# Altium schematic sheet ee453_pcb_N-B-S.SchDoc: EE 453 Capstone
size C; ApprovedBy: Your Name; CheckedBy: Your Name; Author: Your Name; CompanyName: Dept. of Elec. and Comp. Engg.; DrawnBy: Your Name; Engineer: Your Nmae; Organization: UW-Seattle; Address1: 185 Stevens Way; Address2: Paul Allen Center; Address3: Seattle, WA; Address4: US-98195; DocumentNumber: 1; Revision: 1.0; SheetNumber: 1; SheetTotal: 1
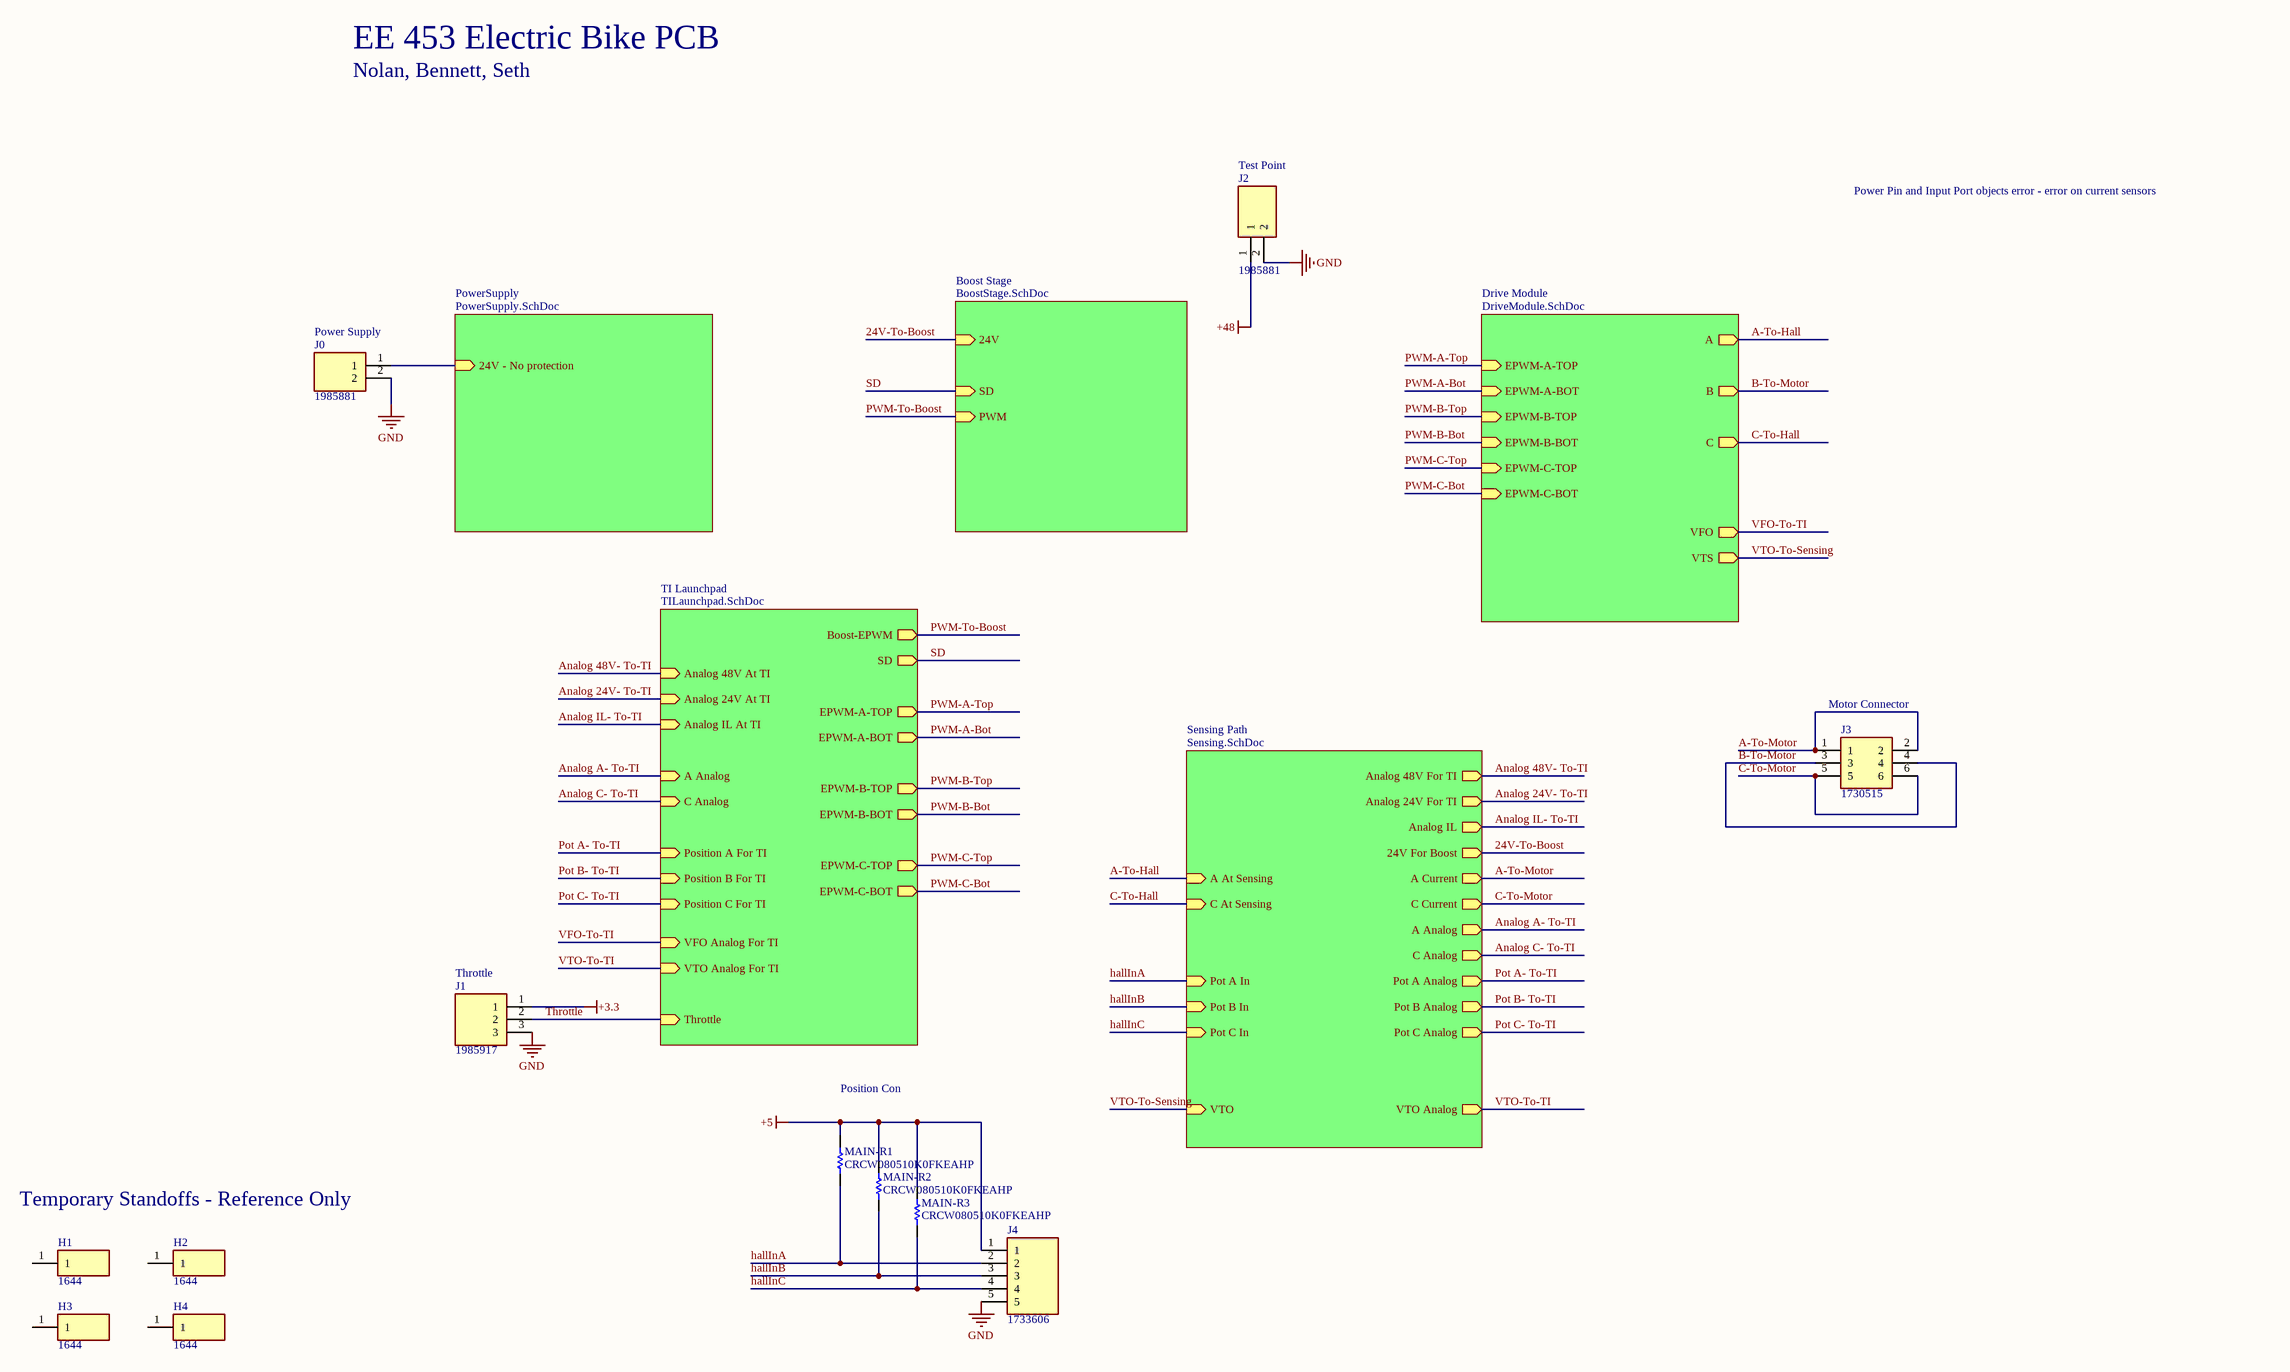
[diagram p0: ee453_pcb_N-B-S.SchDoc]

## Parts
H1  1644  [1644]
H2  1644  [1644]
H3  1644  [1644]
H4  1644  [1644]
J0  1985881  [1985881]
J1  1985917  [1985917]
J2  1985881  [1985881]
J3  1730515  [1730515]
J4  1733606  [1733606]
MAIN-R1  CRCW080510K0FKEAHP  [RESC2013X60X40NL15T20]
MAIN-R2  CRCW080510K0FKEAHP  [RESC2013X60X40NL15T20]
MAIN-R3  CRCW080510K0FKEAHP  [RESC2013X60X40NL15T20]

## Sub-sheets
Boost Stage = BoostStage.SchDoc: 24V (in), SD (in), PWM (in)
Drive Module = DriveModule.SchDoc: EPWM-A-TOP (in), EPWM-A-BOT (in), EPWM-B-TOP (in), EPWM-B-BOT (in), EPWM-C-TOP (in), EPWM-C-BOT (in), A (out), B (out), C (out), VFO (out), VTS (out)
PowerSupply = PowerSupply.SchDoc: 24V - No protection (in)
Sensing Path = Sensing.SchDoc: A At Sensing (in), C At Sensing (in), Analog 24V For TI (out), Analog IL (out), A Current (out), C Current (out), Analog 48V For TI (out), Pot A Analog (out), Pot B Analog (out), Pot C Analog (out), Pot A In (in), Pot B In (in), Pot C In (in), A Analog (out), C Analog (out), 24V For Boost (out), VTO Analog (out), VTO (in)
TI Launchpad = TILaunchpad.SchDoc: Analog 24V At TI (in), Analog IL At TI (in), A Analog (in), C Analog (in), Boost-EPWM (out), EPWM-A-TOP (out), EPWM-A-BOT (out), EPWM-B-TOP (out), EPWM-B-BOT (out), EPWM-C-TOP (out), EPWM-C-BOT (out), Position A For TI (in), Position B For TI (in), Position C For TI (in), SD (out), Analog 48V At TI (in), VFO Analog For TI (in), VTO Analog For TI (in), Throttle (in)

## Nets
+3.3: J1.1
+5: J4.1 MAIN-R1.2 MAIN-R2.2 MAIN-R3.2
+48: J2.1
GND: J0.2 J1.3 J2.2 J4.5
24V-To-Boost: sheet Boost Stage/24V, sheet Sensing Path/24V For Boost
A-To-Hall: sheet Drive Module/A, sheet Sensing Path/A At Sensing
A-To-Motor: J3.1 J3.2 ; sheet Sensing Path/A Current
Analog 24V- To-TI: sheet TI Launchpad/Analog 24V At TI, sheet Sensing Path/Analog 24V For TI
Analog 48V- To-TI: sheet TI Launchpad/Analog 48V At TI, sheet Sensing Path/Analog 48V For TI
Analog A- To-TI: sheet TI Launchpad/A Analog, sheet Sensing Path/A Analog
Analog C- To-TI: sheet TI Launchpad/C Analog, sheet Sensing Path/C Analog
Analog IL- To-TI: sheet TI Launchpad/Analog IL At TI, sheet Sensing Path/Analog IL
B-To-Motor: J3.3 J3.4 ; sheet Drive Module/B
C-To-Hall: sheet Drive Module/C, sheet Sensing Path/C At Sensing
C-To-Motor: J3.5 J3.6 ; sheet Sensing Path/C Current
hallInA: J4.2 MAIN-R1.1 ; sheet Sensing Path/Pot A In
hallInB: J4.3 MAIN-R2.1 ; sheet Sensing Path/Pot B In
hallInC: J4.4 MAIN-R3.1 ; sheet Sensing Path/Pot C In
Pot A- To-TI: sheet TI Launchpad/Position A For TI, sheet Sensing Path/Pot A Analog
Pot B- To-TI: sheet TI Launchpad/Position B For TI, sheet Sensing Path/Pot B Analog
Pot C- To-TI: sheet TI Launchpad/Position C For TI, sheet Sensing Path/Pot C Analog
PWM-A-Bot: sheet TI Launchpad/EPWM-A-BOT, sheet Drive Module/EPWM-A-BOT
PWM-A-Top: sheet TI Launchpad/EPWM-A-TOP, sheet Drive Module/EPWM-A-TOP
PWM-B-Bot: sheet TI Launchpad/EPWM-B-BOT, sheet Drive Module/EPWM-B-BOT
PWM-B-Top: sheet TI Launchpad/EPWM-B-TOP, sheet Drive Module/EPWM-B-TOP
PWM-C-Bot: sheet TI Launchpad/EPWM-C-BOT, sheet Drive Module/EPWM-C-BOT
PWM-C-Top: sheet TI Launchpad/EPWM-C-TOP, sheet Drive Module/EPWM-C-TOP
PWM-To-Boost: sheet TI Launchpad/Boost-EPWM, sheet Boost Stage/PWM
SD: sheet TI Launchpad/SD, sheet Boost Stage/SD
Throttle: J1.2 ; sheet TI Launchpad/Throttle
VFO-To-TI: sheet TI Launchpad/VFO Analog For TI, sheet Drive Module/VFO
VTO-To-Sensing: sheet Drive Module/VTS, sheet Sensing Path/VTO
VTO-To-TI: sheet TI Launchpad/VTO Analog For TI, sheet Sensing Path/VTO Analog
NetJ0_1: J0.1 ; sheet PowerSupply/24V - No protection

Not connected (* = marked no-connect by the designer): H1 1; H2 1; H3 1; H4 1

## Notes on the sheet
- EE 453 Electric Bike PCB
- Nolan, Bennett, Seth
- Test Point
- Power Pin and Input Port objects error - error on current sensors
- (near J0) Power Supply
- (near J3) Motor Connector
- (near J1) Throttle
- Position Con
- Temporary Standoffs - Reference Only
- Title
- Size:
- Date:
- File:
- C
- Number:
- Time:
- Revision:
- Sheet
- of

## Library data of the parts
H1-H4 = 1644: Hardware; Manufacturer_Name: Keystone Electronics; Datasheet Link: https://www.mouser.com/datasheet/2/215/644-745864.pdf; Height: 25.4mm; Manufacturer_Part_Number: 1644; Mouser Part Number: 534-1644; Mouser Price/Stock: https://www.mouser.com/Search/Refine.aspx?Keyword=534-1644
J0 J2 = 1985881: Connector; Manufacturer_Name: Phoenix Contact; Datasheet Link: https://www.digikey.com/en/products/detail/phoenix-contact/1985881/2511015; Height: 13.9mm; Manufacturer_Part_Number: 1985881
J1 = 1985917: Connector; Manufacturer_Name: Phoenix Contact; Datasheet Link: https://media.digikey.com/pdf/Data%20Sheets/Phoenix%20Contact%20PDFs/Multi-Postion%20PCTerminal%20Blocks.pdf; Height: 13.95mm; Manufacturer_Part_Number: 1985917; Mouser Part Number: 651-1985917; Mouser Price/Stock: https://www.mouser.co.uk/ProductDetail/Phoenix-Contact/1985917/?qs=ibOxrZ%2Fd8eDdpJplVMXgvQ%3D%3D; Arrow Part Number: 1985917; Arrow Price/Stock: https://www.arrow.com/en/products/1985917/phoenix-contact
J3 = 1730515: Connector; Manufacturer_Name: Phoenix Contact; Datasheet Link: https://media.digikey.com/PDF/Data%20Sheets/Phoenix%20Contact%20PDFs/1730515.pdf; Height: 18mm; Manufacturer_Part_Number: 1730515; Mouser Part Number: 651-1730515; Mouser Price/Stock: https://www.mouser.com/Search/Refine.aspx?Keyword=651-1730515; Arrow Part Number: 1730515; Arrow Price/Stock: https://www.arrow.com/en/products/1730515/phoenix-contact
J4 = 1733606: Connector; Manufacturer_Name: Phoenix Contact; Datasheet Link: https://www.phoenixcontact.com/online/portal/us?uri=pxc-oc-itemdetail:pid=1733606&library=usen&tab=1; Height: 15.45mm; Manufacturer_Part_Number: 1733606; Mouser Part Number: 651-1733606; Mouser Price/Stock: https://www.mouser.co.uk/ProductDetail/Phoenix-Contact/1733606/?qs=coeDwHeOZKnxpzvXWWKBZQ%3D%3D; Arrow Part Number: 1733606; Arrow Price/Stock: https://www.arrow.com/en/products/1733606/phoenix-contact
MAIN-R1-MAIN-R3 = CMP-2001-04472-1: Manufacturer: Vishay Dale; Part Number: CRCW080510K0FKEAHP